# EAGLE design SmartThermo1.4 (EAGLE 8.4.0)
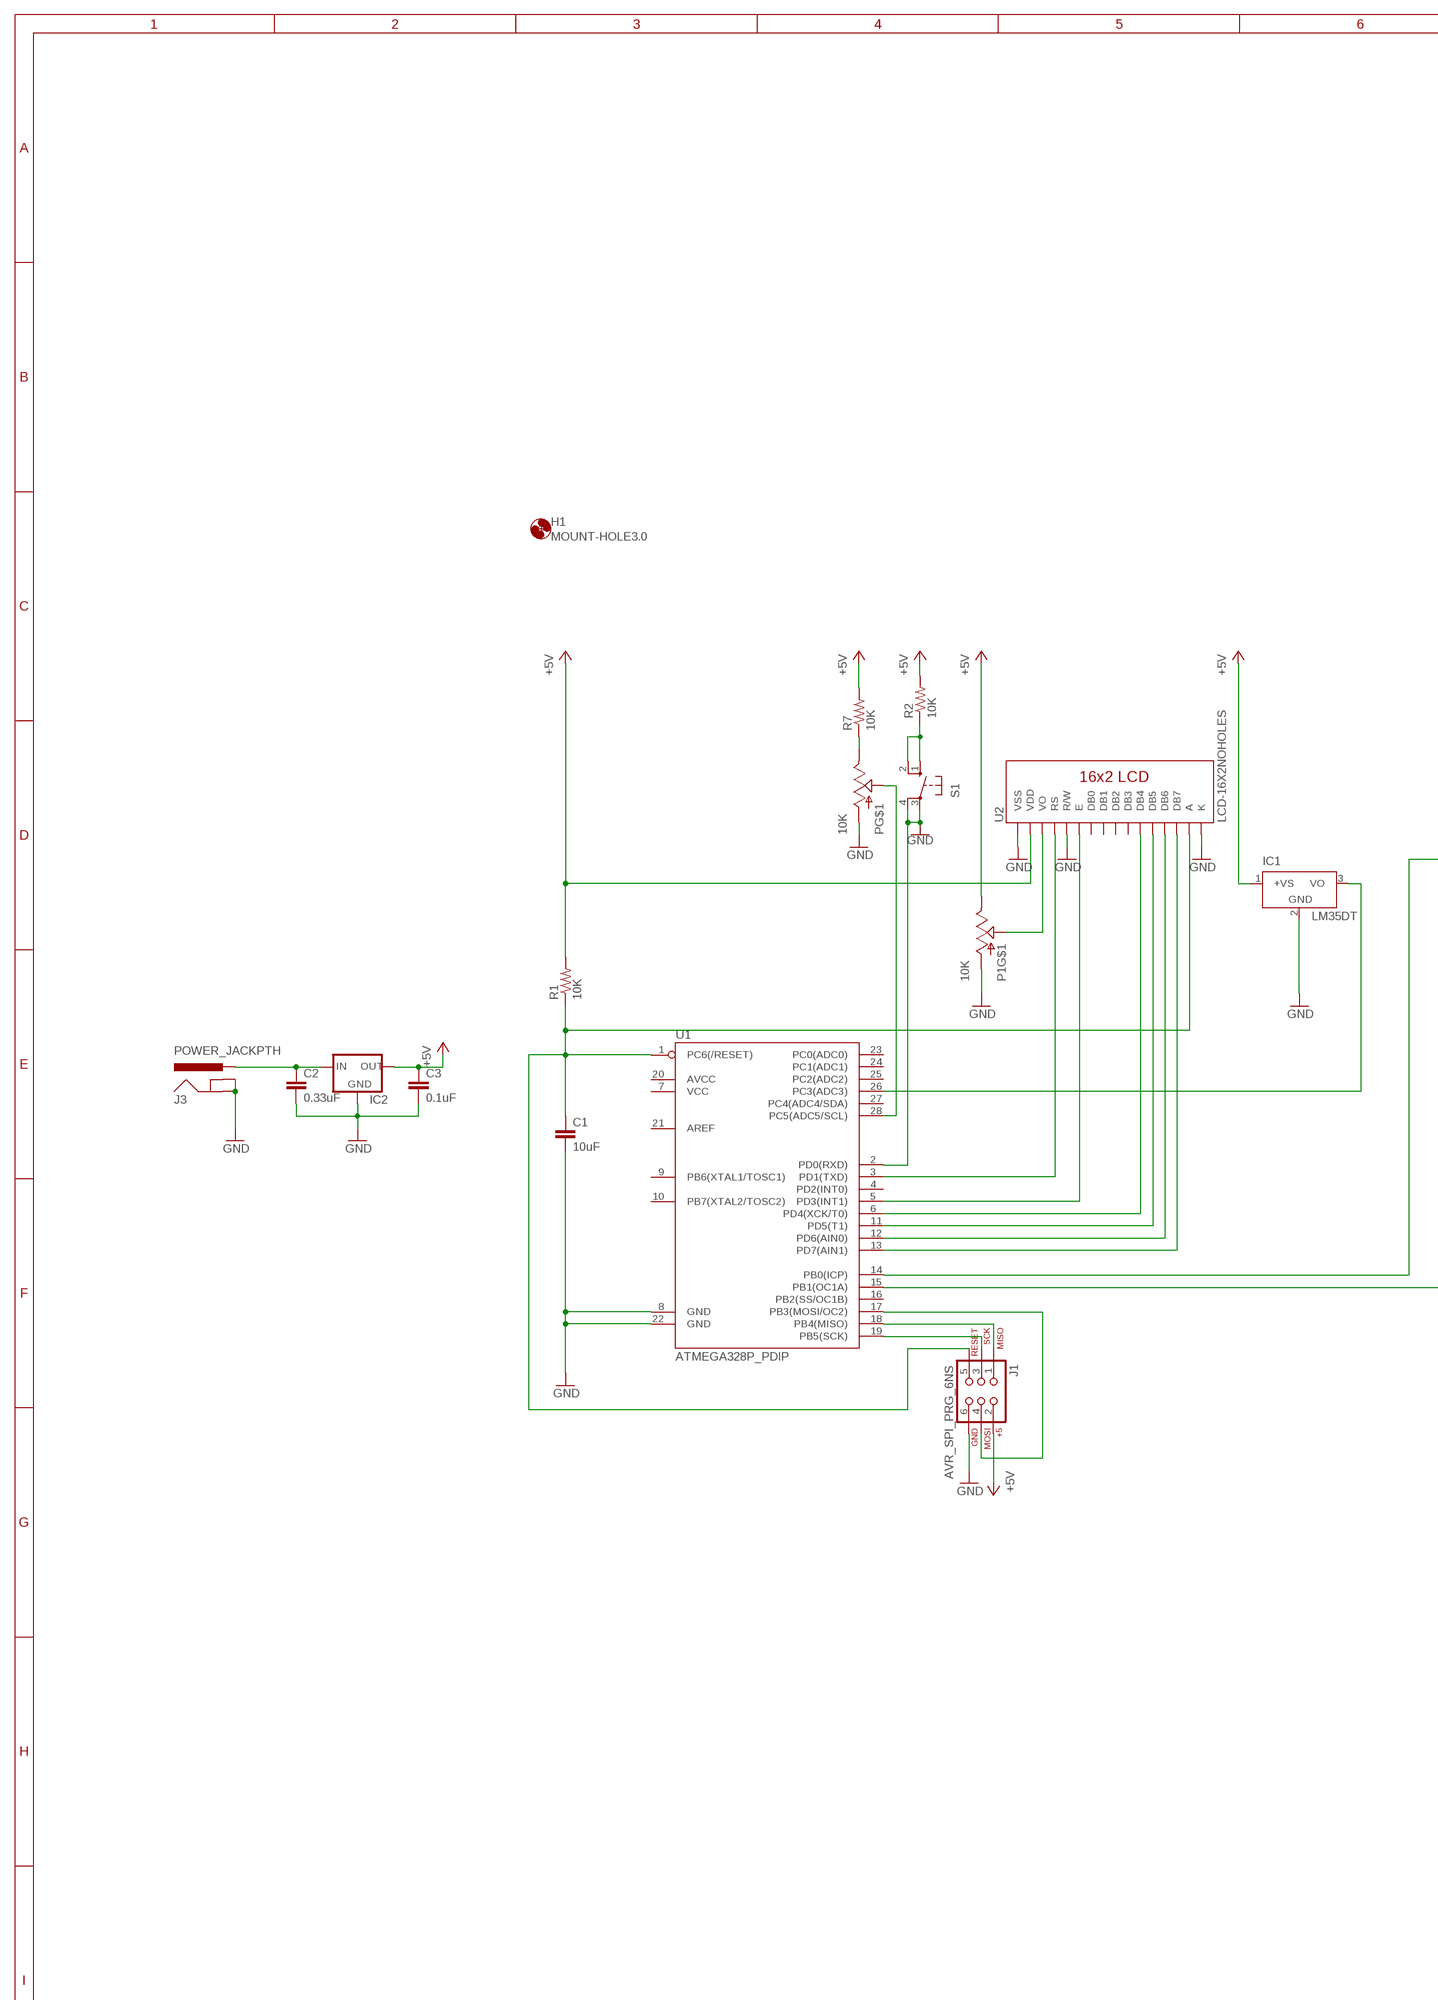
[diagram p0: schematic, sheet 1, part 1 of 2]
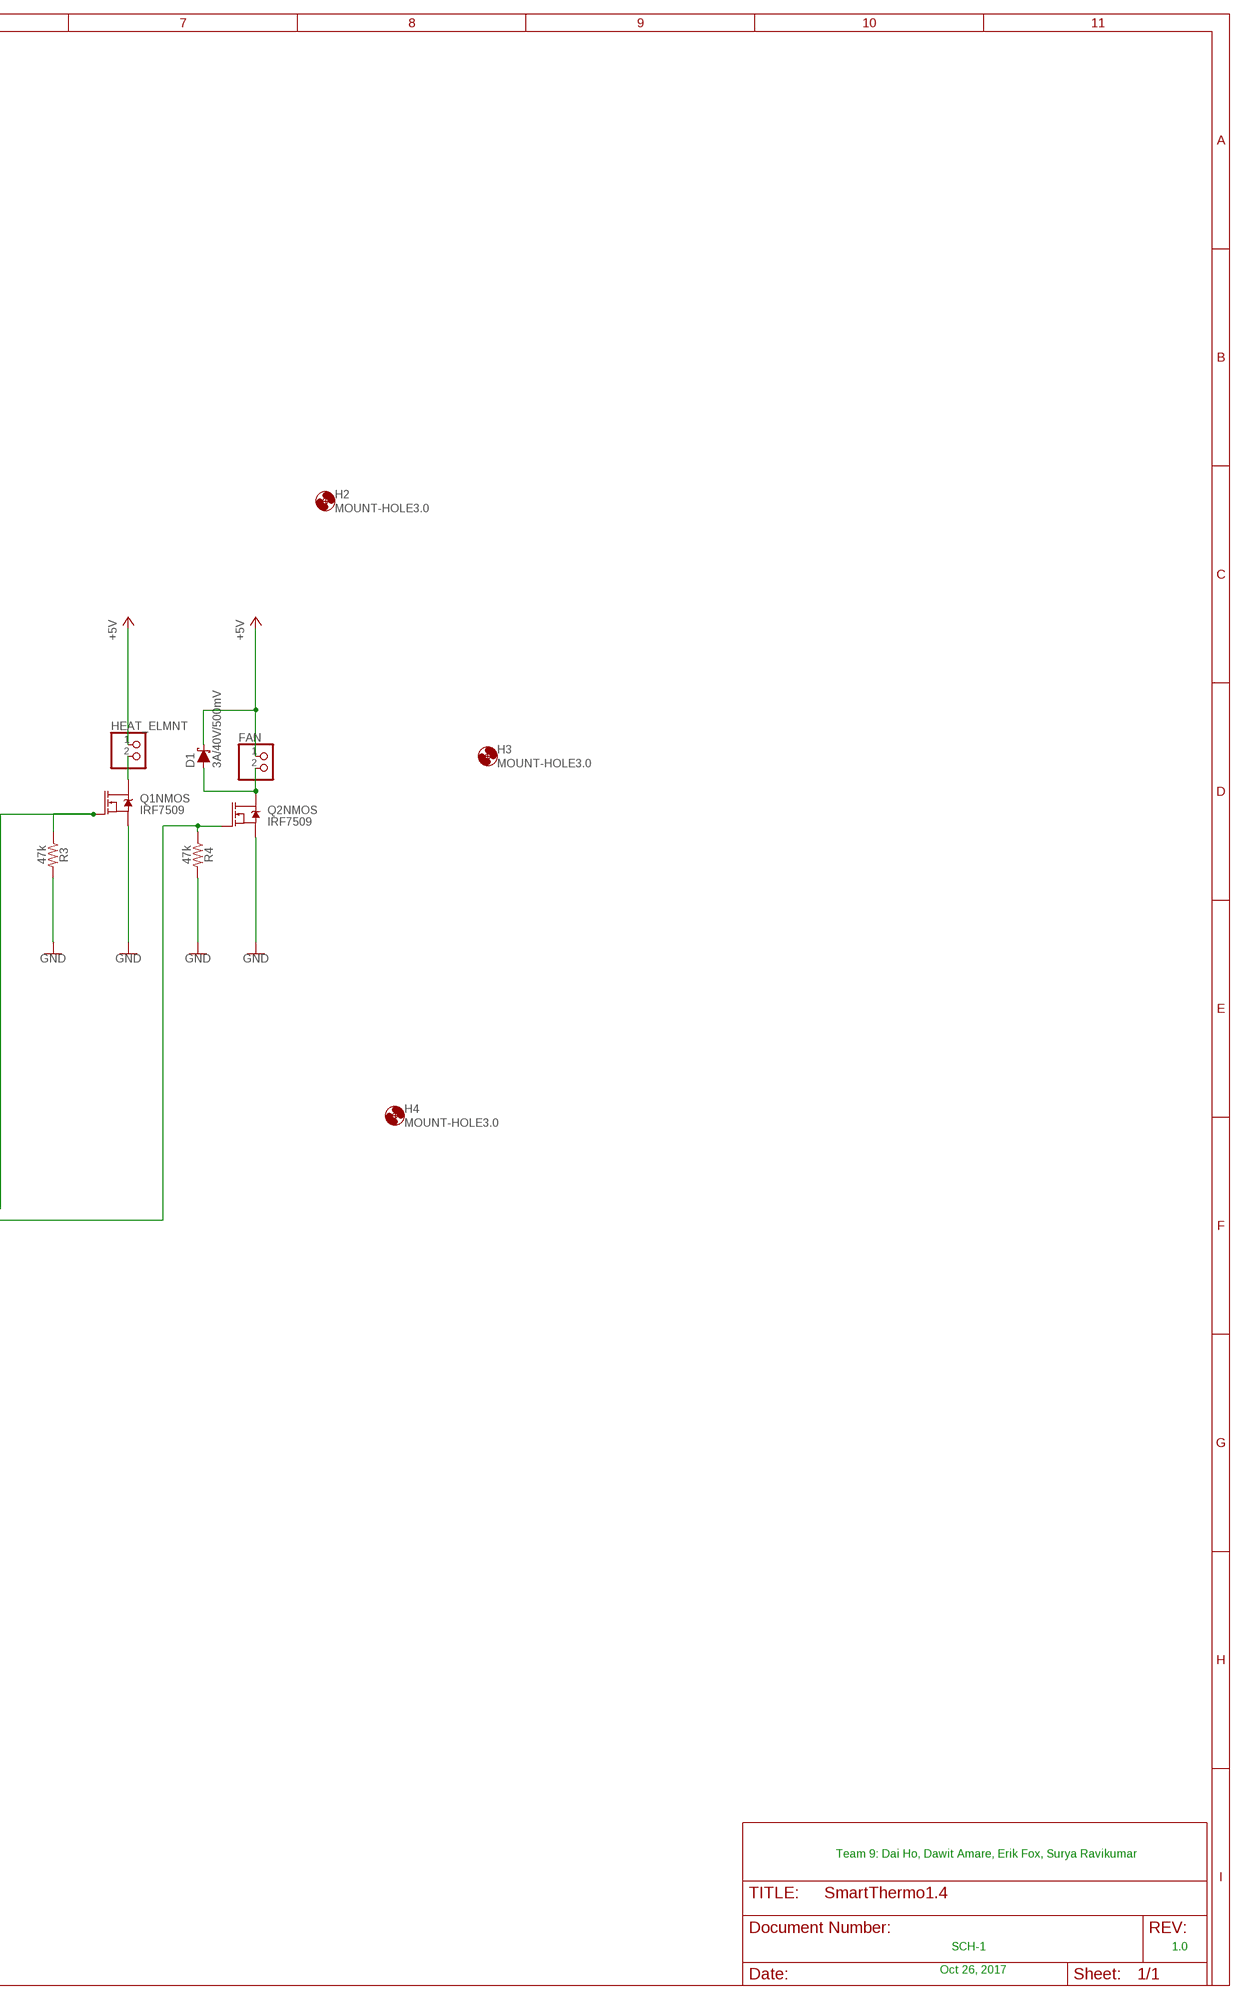
[diagram p1: schematic, sheet 1, part 2 of 2]

## Parts
C1  10uF  10UF-6.3V-20%(1206)  [1206]
C2  0.33uF  C7.5/3  [C7.5B3]
C3  0.1uF  C7.5/3  [C7.5B3]
D1  3A/40V/500mV  DIODE-SCHOTTKY-B340A  [SMA-DIODE]
FAN  PINHD-1X2/90  [1X02/90]
H1  MOUNT-HOLE3.0  [3,0]
H2  MOUNT-HOLE3.0  [3,0]
H3  MOUNT-HOLE3.0  [3,0]
H4  MOUNT-HOLE3.0  [3,0]
HEAT_ELMNT  PINHD-1X2/90  [1X02/90]
IC1  LM35DT  [TO220V]
IC2  78XXL  [78XXL]
J1  AVR_SPI_PRG_6NS  [2X3-NS]
J3  POWER_JACKPTH  [POWER_JACK_PTH]
P  10K  POT_SWITCHPOT_PTH  [POT_PTH]
P1  10K  POT_SWITCHPOT_PTH  [POT_PTH]
Q1  IRF7509  [MSOP8]
Q2  IRF7509  [MSOP8]
R1  10K  RESISTOR1206  [1206]
R2  10K  RESISTOR1206  [1206]
R3  47k  47KOHM-0603-1/10W-1%  [0603]
R4  47k  47KOHM-0603-1/10W-1%  [0603]
R7  10K  RESISTOR1206  [1206]
S1  10-XX  [B3F-10XX]
U1  ATMEGA328P_PDIP  [DIL28-3]
U2  LCD-16X2NOHOLES  [LCD-16X2_NOHOLES]

## Nets
+5V: C3.1 D1.C FAN.1 HEAT_ELMNT.1 IC1.1(+VS) IC2.OUT J1.2 P1.E@2(E) R1.2 R2.2 R7.2 U2.2(VDD)
GND: C1.2 C2.2 C3.2 IC1.2(GND) IC2.GND J1.6 J3.GND J3.GNDBREAK P1.E@1(A) P.E@1(A) Q1.1(NMOS:S) Q2.1(NMOS:S) R3.2 R4.2 S1.3(P) S1.4(P1) U1.2(PD0(RXD)) U1.8(GND) U1.22(GND) U2.1(VSS) U2.5(R/W) U2.16(K)
N$1: C1.1 J1.5 R1.1 U1.1(PC6(/RESET)) U2.15(A)
N$2: IC1.3(VO) U1.26(PC3(ADC3))
N$3: P.WAND(S) U1.28(PC5(ADC5/SCL))
N$4: Q2.2(NMOS:G) R4.1 U1.15(PB1(OC1A))
N$5: U1.3(PD1(TXD)) U2.4(RS)
N$6: P1.WAND(S) U2.3(VO)
N$7: U1.5(PD3(INT1)) U2.6(E)
N$8: U1.6(PD4(XCK/T0)) U2.11(DB4)
N$9: U1.11(PD5(T1)) U2.12(DB5)
N$10: U1.12(PD6(AIN0)) U2.13(DB6)
N$11: U1.13(PD7(AIN1)) U2.14(DB7)
N$12: C2.1 IC2.IN J3.PWR
N$13: D1.A FAN.2 Q2.7(NMOS:D) Q2.8(NMOS:D)
N$15: R2.1 S1.1(S) S1.2(S1)
N$16: J1.1 U1.18(PB4(MISO))
N$17: P.E@2(E) R7.1
N$18: J1.4 U1.17(PB3(MOSI/OC2))
N$19: Q1.2(NMOS:G) R3.1 U1.14(PB0(ICP))
N$20: J1.3 U1.19(PB5(SCK))
N$21: HEAT_ELMNT.2 Q1.7(NMOS:D) Q1.8(NMOS:D)
Unconnected: P1.S1 P1.S2 P.S1 P.S2 Q1.3(PMOS:S) Q1.4(PMOS:G) Q1.5(PMOS:D) Q1.6(PMOS:D) Q2.3(PMOS:S) Q2.4(PMOS:G) Q2.5(PMOS:D) Q2.6(PMOS:D) U1.4(PD2(INT0)) U1.7(VCC) U1.9(PB6(XTAL1/TOSC1)) U1.10(PB7(XTAL2/TOSC2)) U1.16(PB2(SS/OC1B)) U1.20(AVCC) U1.21(AREF) U1.23(PC0(ADC0)) U1.24(PC1(ADC1)) U1.25(PC2(ADC2)) U1.27(PC4(ADC4/SDA)) U2.7(DB0) U2.8(DB1) U2.9(DB2) U2.10(DB3)

## Notes on the sheet
- Team 9: Dai Ho, Dawit Amare, Erik Fox, Surya Ravikumar
- SCH-1 | 1.0
- Oct 26, 2017

## Library data of the parts
C1 = SparkFun-Capacitors:10UF-6.3V-20%(1206): CAP-10057 Ceramic; PROD_ID: CAP-10057
C2 C3 = capacitor-wima:C: CAPACITOR naming: grid - package width
D1 = SparkFun-DiscreteSemi:DIODE-SCHOTTKY: Schottky diode A Schottky diode is a semiconductor diode which has a low forward voltage drop and a very fast switching action.; PROD_ID: DIO-09886
FAN HEAT_ELMNT = pinhead:PINHD-1X2: PIN HEADER
H1-H4 = holes:MOUNT-HOLE: MOUNTING HOLE with drill center marker
IC1 = lm35:LM35: Single-Supply Centigrade Temperature Sensor Vout = (10mV/°C x Temp °C) +5mmmV Source: http://www.national.com/ds/LM/LM35.pdf
IC2 = v-reg:78XXL: VOLTAGE REGULATOR
J1 = SparkFun-Connectors:AVR_SPI_PRG_6: AVR ISP 6 Pin This is the reduced ISP connector for AVR programming. Common on Arduino. This footprint will take up less PCB space and can be used with a 10-pin to 6-pin adapter such as SKU: BOB-08508 **Special note about "TEST_POINT" package. The stop mask is on the top side, so if you want your programming test points to be on the bottom of your board, make sure to place this package on the bottom side of the board. This also ensure that the orientation to program from the bottom side will be correct.
J3 = SparkFun-Connectors:POWER_JACK: Power Jack This is the standard 5.5mm barrel jack for power. The PTH is the most common, proven, reliable, footprint. The Slot footprint only works if the mill layer is transmitted to the PCB fab house so be warned. Mating wall wart : TOL-00298 (and others); PROD_ID: CONN-08197
P P1 = button_TestFootprint:POT_SWITCH: Potentiometer w/ switch.
Q1 Q2 = SparkFun-DiscreteSemi:IRF7509: Dual N and P Channel MOSFET Dual N/P-Channel 30V 1.25 W 7.8/7.5 nC Hexfet Power Mosfet Surface Mount-MICRO-8. NMOS RDS(ON) 0.11Ω. PMOS RDS(ON) 0.20Ω. Link to datasheet <http://www.irf.com/product-info/datasheets/data/irf7509pbf.pdf> SparkFun Products: SparkFun RedBot Mainboard <https://www.sparkfun.com/products/12097> SparkFun Wake on Shake <https://www.sparkfun.com/products/11447>; PROD_ID: TRANS-07913
R1 R2 R7 = SparkFun-Passives:RESISTOR: Resistor Basic schematic elements and footprints for 0603, 1206, and PTH resistors.
R3 R4 = SparkFun-Resistors:47KOHM: 47kΩ resistor A resistor is a passive two-terminal electrical component that implements electrical resistance as a circuit element. Resistors act to reduce current flow, and, at the same time, act to lower voltage levels within circuits. - Wikipedia; PROD_ID: RES-07871
S1 = switch-omron:10-XX: OMRON SWITCH; MPN: B3F-1000; OC_FARNELL: 176432; OC_NEWARK: 36M3542
U1 = SparkFun-DigitalIC:ATMEGA328P_PDIP: uC used in the Arduino 32kb flash, 1k EEPROM, 2k SRAM This is the through-hole version of this chip.
U2 = SparkFun-Displays:LCD-16X2: Standard text-only 16x2 parallel input LCD

## Board
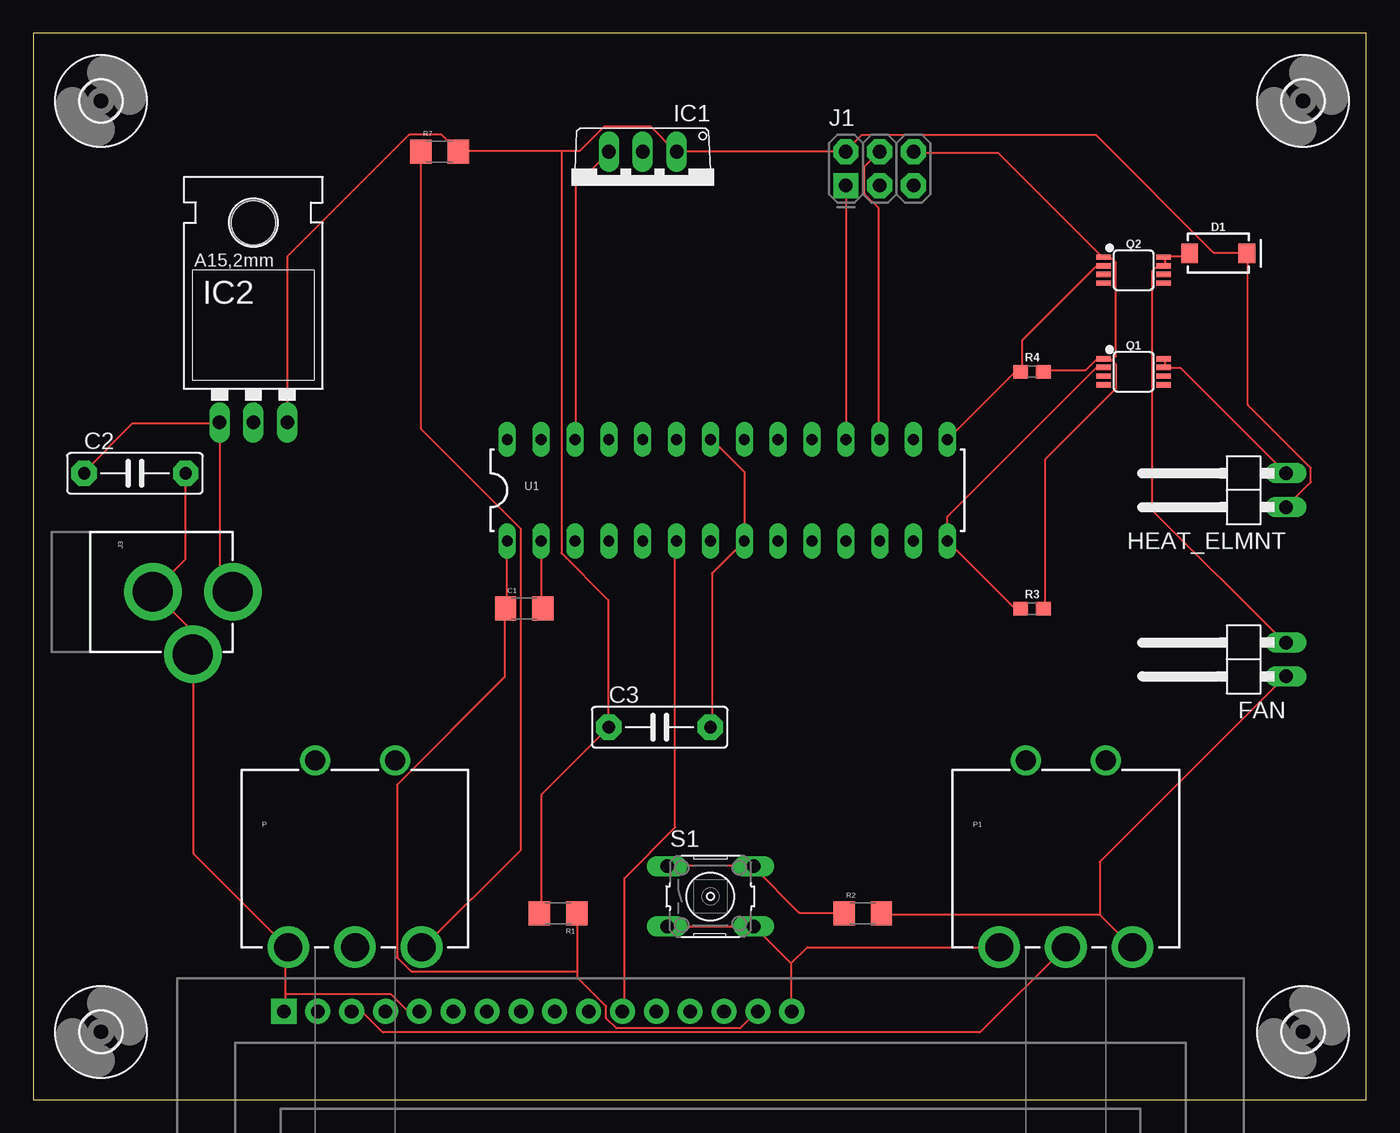
[diagram p2: board, top side]
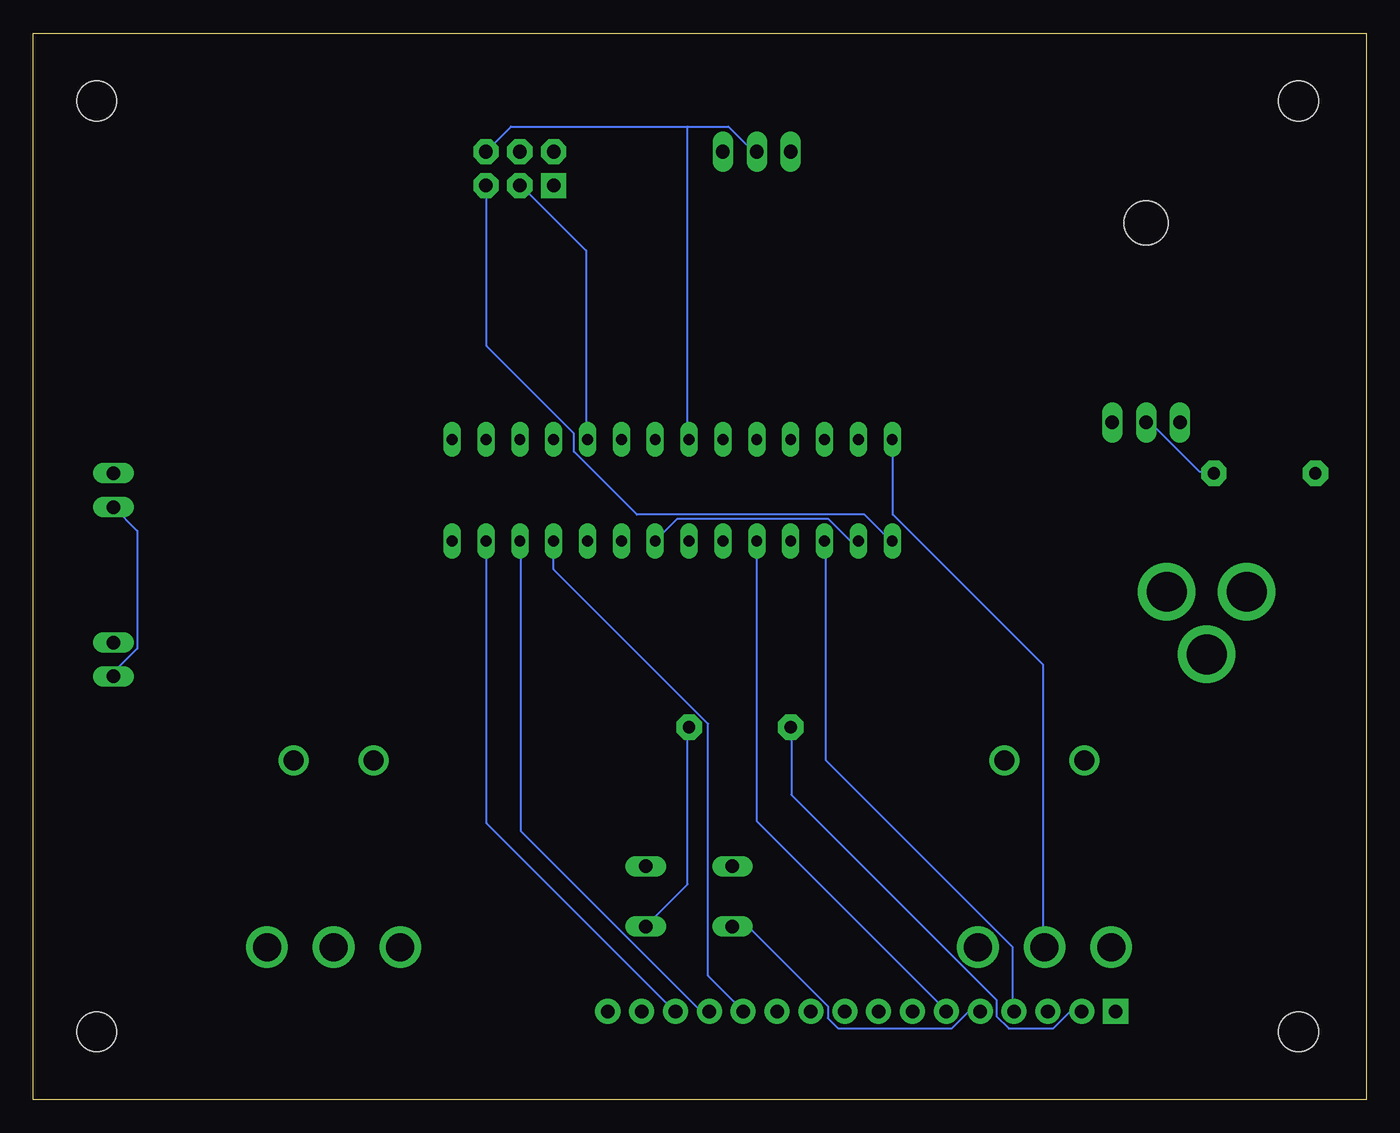
[diagram p3: board, bottom side, seen from below]

Size 100 x 80 mm. Coordinates in mm from the lower left corner, seen from the top.
Outline: 0,0 100,0 100,80 0,80 0,0
Copper layers (1*16): Top 0.035mm / dielectric 1.5mm / Bottom 0.035mm
Design rules "default": minimum track width 6mil, minimum drill 0.35mm, track to track 6mil, track to pad 6mil, pad to pad 6mil, via to via 6mil, smd to smd 6mil, copper to edge 40mil, drill to drill 6mil, minimum pad ring 10mil, minimum via ring 8mil, stop-mask expansion 4mil, vias tented up to drill 0mil, thermal gap 10mil

### Footprints (pad centres in the part's own frame; a part is rotated, then mirrored left to right if it is on the bottom)
1206 = smd 1.6 x 1.8: 1 -1.4,0; 2 1.4,0
C7.5B3 = drill 0.914 pad 1.905 octagon: 1 -3.81,0; 2 3.81,0
SMA-DIODE = smd 1.27 x 1.47: A -2.15,0; C 2.15,0
1X02/90 = drill 1.016 long: 1 -1.27,-3.81; 2 1.27,-3.81
3,0 = hole 3: 0,0
TO220V = drill 1.016 long: 1 -2.54,-2.54; 2 0,-2.54; 3 2.54,-2.54
78XXL = drill 1.016 long: GND 0,-3.81; IN -2.54,-3.81; OUT 2.54,-3.81 | hole 3.302: 0,11.176
2X3-NS = drill 1.016 pad 1.88 square: 1 -2.54,-1.27 | drill 1.016 pad 1.88 octagon: 2 -2.54,1.27; 3 0,-1.27; 4 0,1.27; 5 2.54,-1.27; 6 2.54,1.27
POWER_JACK_PTH = drill 2.997 pad 4.318: GND 0,7.7; GNDBREAK 4.7,10.7; PWR 0,13.7
POT_PTH = drill 2.1: E@1 -5,0; E@2 5,0; WAND 0,0 | drill 1.5: S1 -3,14; S2 3,14
MSOP8 = smd 0.4 x 1.1: 1 -0.975,-2.25; 2 -0.325,-2.25; 3 0.325,-2.25; 4 0.975,-2.25; 5 0.975,2.25; 6 0.325,2.25; 7 -0.325,2.25; 8 -0.975,2.25
0603 = smd 1.1 x 1: 1 -0.85,0; 2 0.85,0
B3F-10XX = drill 1.016 long: 1 -3.251,2.261; 2 3.251,2.261; 3 -3.251,-2.261; 4 3.251,-2.261
DIL28-3 = drill 0.813 long: 1 -16.51,-3.81; 2 -13.97,-3.81; 3 -11.43,-3.81; 4 -8.89,-3.81; 5 -6.35,-3.81; 6 -3.81,-3.81; 7 -1.27,-3.81; 8 1.27,-3.81; 9 3.81,-3.81; 10 6.35,-3.81; 11 8.89,-3.81; 12 11.43,-3.81; 13 13.97,-3.81; 14 16.51,-3.81; 15 16.51,3.81; 16 13.97,3.81; 17 11.43,3.81; 18 8.89,3.81; 19 6.35,3.81; 20 3.81,3.81; 21 1.27,3.81; 22 -1.27,3.81; 23 -3.81,3.81; 24 -6.35,3.81; 25 -8.89,3.81; 26 -11.43,3.81; 27 -13.97,3.81; 28 -16.51,3.81
LCD-16X2_NOHOLES = drill 1.016 pad 1.88 square: 1 -32,15.5 | drill 1.016 pad 1.88: 2 -29.46,15.5; 3 -26.92,15.5; 4 -24.38,15.5; 5 -21.84,15.5; 6 -19.3,15.5; 7 -16.76,15.5; 8 -14.22,15.5; 9 -11.68,15.5; 10 -9.14,15.5; 11 -6.6,15.5; 12 -4.06,15.5; 13 -1.52,15.5; 14 1.02,15.5; 15 3.56,15.5; 16 6.1,15.5

### Placement (x,y rotation side)
C1  36.83,36.83 0 top
C2  7.62,46.99 0 top
C3  46.99,27.94 0 top
D1  88.9,63.5 0 top
FAN  90.17,33.02 90 top
H1  95.25,5.08 0 top
H2  5.08,5.08 0 top
H3  95.25,74.93 0 top
H4  5.08,74.93 0 top
HEAT_ELMNT  90.17,45.72 90 top
IC1  45.72,68.58 180 top
IC2  16.51,54.61 0 top
J1  63.5,69.85 0 top
J3  1.27,38.1 270 top
P  24.13,11.43 0 top
P1  77.47,11.43 0 top
Q1  82.55,54.61 270 top
Q2  82.55,62.23 270 top
R1  39.37,13.97 180 top
R2  62.23,13.97 0 top
R3  74.93,36.83 0 top
R4  74.93,54.61 0 top
R7  30.48,71.12 0 top
S1  50.8,15.24 0 top
U1  52.07,45.72 0 top
U2  50.8,-8.89 0 top

### Tracks (layer width: path | path; a pad name or v marks a point on that pad's centre or on a via)
+5V
  Top 0.152: 80.01,13.87 63.7,13.87 R2.2 | 80.01,13.87 82.45,11.43 P1.E@2 | HEAT_ELMNT.1 95.86,46.33 95.86,47.4 91.14,52.12 91.14,63.4 D1.C 90.98,63.55 88.54,63.55 79.7,72.39 62.18,72.39 60.96,71.17 | 80.01,13.87 80.01,17.83 93.88,31.7 FAN.1 | R1.2 38.1,14.02 38.1,22.86 C3.1 43.13,28.04 43.13,37.49 39.62,41 39.62,71.17 | 39.62,71.17 41,71.17 42.82,73 46.33,73 48.16,71.17 IC1.1 48.31,71.17 60.96,71.17 | 39.62,71.17 32,71.17 R7.2 31.85,71.17 30.63,72.39 28.19,72.39 19.05,63.25 IC2.OUT | 60.96,71.17 J1.2
  Bottom 0.152: HEAT_ELMNT.1 92.2,42.67 92.2,33.83 93.88,32.16 93.88,31.85 FAN.1 | U2.2 21.49,6.55 22.25,6.55 23.47,5.33 26.82,5.33 27.74,6.25 27.74,7.47 43.13,22.86 43.13,27.89 C3.1
GND
  Top 0.152: 80.92,55.47 81.23,55.17 81.23,53.34 75.89,48.01 75.89,36.88 R3.2 | 80.92,55.47 80.31,55.47 Q1.1 80.16,55.47 79.7,55.47 78.94,54.71 75.89,54.71 R4.2 | 80.92,55.47 81.23,55.78 81.23,62.79 80.92,63.09 80.31,63.09 Q2.1 80.16,63.25 72.39,71.02 66.14,71.02 J1.6 | U1.2 38.1,36.88 C1.2 | U1.22 50.9,49.53 53.34,47.09 U1.8 50.9,39.47 50.9,28.04 C3.2 | C2.2 11.43,40.54 8.99,38.1 | 8.99,38.1 11.89,35.2 11.89,33.53 J3.GNDBREAK 12.04,33.38 12.04,18.44 19.05,11.43 | 8.99,38.1 J3.GND | 18.9,7.92 18.9,11.28 19.05,11.43 | 18.9,7.92 18.9,6.71 U2.1 | 18.9,7.92 26.82,7.92 28.04,6.71 28.96,6.71 U2.5 | S1.3 47.55,12.95 53.95,12.95 S1.4 54.1,12.95 56.84,10.21 | 56.84,10.21 56.84,6.71 U2.16 | P1.E@1 58.06,11.43 56.84,10.21 | 19.05,11.43 P.E@1
  Bottom 0.152: 50.9,73 64.16,73 J1.6 | 50.9,73 47.85,73 46.02,71.17 45.72,71.17 IC1.2 | U1.2 38.71,41.91 40.39,43.59 51.66,43.59 U1.8 | IC2.GND 16.46,50.75 16.15,50.75 12.5,47.09 11.43,47.09 C2.2 | U2.5 29.11,6.55 29.87,6.55 31.09,5.33 39.62,5.33 40.39,6.1 40.39,7.01 46.33,12.95 47.55,12.95 S1.3 | C3.2 50.9,27.89 50.9,16.15 53.95,13.11 S1.4 | 50.9,73 50.9,49.53 U1.22
N$1
  Top 0.152: 40.84,9.6 40.84,9.14 42.98,7.01 42.98,6.1 43.74,5.33 53.03,5.33 54.25,6.55 U2.15 | 40.84,9.6 40.84,13.87 R1.1 | U1.1 35.51,41.91 35.51,36.88 C1.1 35.36,36.73 35.36,31.7 27.28,23.62 27.28,10.67 28.35,9.6 40.84,9.6
  Bottom 0.152: J1.5 65.99,68.58 65.99,56.54 59.44,49.99 59.44,48.62 54.71,43.89 37.64,43.89 35.66,41.91 U1.1
N$2
  Top 0.152: U1.26 40.69,49.53 40.69,68.58 43.13,71.02 IC1.3
N$3
  Bottom 0.152: U1.28 35.51,49.53 35.51,43.89 24.23,32.61 24.23,11.43 P.WAND
N$4
  Top 0.152: U1.15 73.61,54.56 74.07,54.56 R4.1 74.22,54.71 74.22,57 79.7,62.48 80.16,62.48 Q2.2
N$5
  Bottom 0.152: U1.3 40.54,41.91 40.54,25.45 26.52,11.43 26.52,6.71 U2.4
N$6
  Top 0.152: U2.3 23.93,6.55 24.69,6.55 26.21,5.03 71.02,5.03 77.42,11.43 P1.WAND
N$7
  Bottom 0.152: U1.5 45.72,20.88 31.55,6.71 U2.6
N$8
  Top 0.152: U1.6 48.16,41.91 48.16,20.42 44.35,16.61 44.35,6.71 U2.11
N$9
  Bottom 0.152: U1.11 60.96,39.78 49.38,28.19 49.38,9.3 46.79,6.71 U2.12
N$10
  Bottom 0.152: U1.12 63.4,41.91 63.4,20.12 49.99,6.71 49.38,6.71 U2.13
N$11
  Bottom 0.152: U1.13 65.99,41.91 65.99,20.73 51.97,6.71 U2.14
N$12
  Top 0.152: C2.1 3.81,47.09 7.47,50.75 13.87,50.75 IC2.IN 14.02,50.75 14.02,39.01 14.94,38.1 J3.PWR
N$13
  Top 0.152: D1.A 86.72,63.4 86.56,63.25 84.89,63.25 Q2.8 84.89,63.09 84.89,62.64 Q2.7 84.73,62.48 84.28,62.48 83.97,62.18 83.97,44.2 93.88,34.29 FAN.2
N$15
  Top 0.152: R2.1 60.81,14.02 57.45,14.02 54.1,17.37 S1.2 53.95,17.53 47.55,17.53 S1.1
N$16
  Top 0.152: J1.1 U1.18
N$17
  Top 0.152: R7.1 29.11,71.02 29.11,50.29 36.58,42.82 36.58,18.75 29.26,11.43 P.E@2
N$18
  Top 0.152: J1.4 62.33,69.95 62.33,67.97 63.4,66.9 63.4,49.53 U1.17
N$19
  Top 0.152: R3.1 74.07,36.88 73.61,36.88 U1.14 68.58,43.74 79.7,54.86 80.16,54.86 Q1.2
N$20
  Bottom 0.152: U1.19 58.52,49.53 58.52,63.7 63.4,68.58 J1.3
N$21
  Top 0.152: Q1.8 84.89,55.47 84.89,55.02 Q1.7 84.89,54.86 86.11,54.86 HEAT_ELMNT.2